# Altium project PCB_Project.PrjPcb
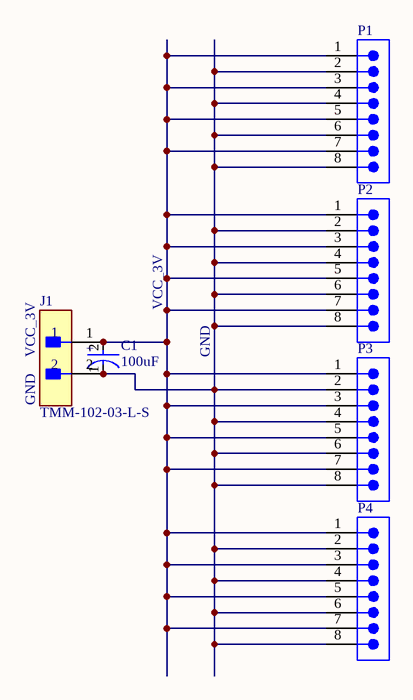
[diagram p0: 24VCC_GNDPort.SchDoc]
1 sheet, 6 parts. Net scope: global (net labels, ports and power ports of the same name join across sheets).
Board file: VCC_VDD.PcbDoc

## Sheet 24VCC_GNDPort.SchDoc
size A4; SheetNumber: 1; SheetTotal: 1

### Parts
C1  100uF  [FP-RAD-TH-D_6_3_0_5-L_11-MFG]
J1  TMM-102-03-L-S  [FP-TMM-102-03-L-S-MFG]
P1  (no value)  [62000811722]
P2  (no value)  [62000811722]
P3  (no value)  [62000811722]
P4  (no value)  [62000811722]

### Nets
NetC1_1: C1.1(C) J1.2 P1.2 P1.4 P1.6 P1.8 P2.2 P2.4 P2.6 P2.8 P3.2 P3.4 P3.6 P3.8 P4.2 P4.4 P4.6 P4.8
NetC1_2: C1.2(A) J1.1 P1.1 P1.3 P1.5 P1.7 P2.1 P2.3 P2.5 P2.7 P3.1 P3.3 P3.5 P3.7 P4.1 P4.3 P4.5 P4.7

### Notes on the sheet
- VCC_3V
- (near J1) VCC_3V
- GND
- (near J1) GND
- (in symbol CMP-05427-000856-1) +

### Library data of the parts
C1 = CMP-05427-000856-1: Aluminum Electrolytic Capacitors (Radial Lead Type) 100uF ±20% 25V; Lead Diameter: 0.5mm; Polarity: Polar; Ripple Current: 455mA; Impedance: 130mR; Life (Hours): 2000Hour; Length: 11mm; Min Operating Temperature: -40°C; Termination: Radial; Diameter: 6mm; Lead Pitch: 5mm; Tolerance: 20%; Capacitance: 100uF; Case/Package: Radial; Voltage Rating (DC): 25V; Height - Seated (Max): 0.5inch; RoHS Compliant: Yes; Series: FM; Package Quantity: 2000; Voltage Rating: 25V; Max Operating Temperature: 105°C; Mount: Through Hole; ESR (Equivalent Series Resistance): 130mR; Packaging: Tape and Reel
J1 = CMP-02766-001502-1: CONN HEADER 2POS SNGL 2MM T/H; Gender: Male; Max Voltage Rating (AC): 500V; Number of Positions: 2; Max Current Rating: 3.9A; Insulation Material: Polymer; Lead Free: Lead Free; Termination: Solder; Contact Type: Male Pin; Number of Rows: 1; Min Operating Temperature: -55°C; Orientation: Straight; Insulation Color: Black; Depth: 1.97mm; Contact Plating: Gold; Housing Material: Polymer; Max Operating Temperature: 125°C; Fastening Type: Pull; Housing Color: Black; Series: TMM; Pitch: 2mm; Packaging: Bulk; Number of Contacts: 2; Radiation Hardening: No; Contact Material: Bronze; RoHS Compliant: Yes; Connector Type: Header; Length: 4mm; Contact Shape: Square; Mount: Through Hole; Package Quantity: 1; Color: Black; Contact Finish - Mating: GOLD; Contact Mating Length: 0.157inch; REACH SVHC: No SVHC
P1-P4 = CMP-1502-00657-3: WR-WTB Wire-to-Board Connectors 2.00 mm; Insulation Resistance: 1GΩ; Current Rating: 2A; Gender: Male; Pitch: 2mm; Max Operating Temperature: 85°C; Length: 18mm; Min Operating Temperature: -25°C; Contact Plating: Tin; Number of Pins: 8